# Altium schematic sheet Main.SchDoc: BF350
size A3; Organization: ORGANIZATION; Address1: ADDRESS 1; Address2: ADDRESS 2; Address3: ADDRESS 3; Address4: ADDRESS 4; Revision: -; SheetNumber: 1; SheetTotal: 1; ENG_APP_DATE: --/--/--; DSN_APP_DATE: --/--/--; CHK_APP_DATE: --/--/--
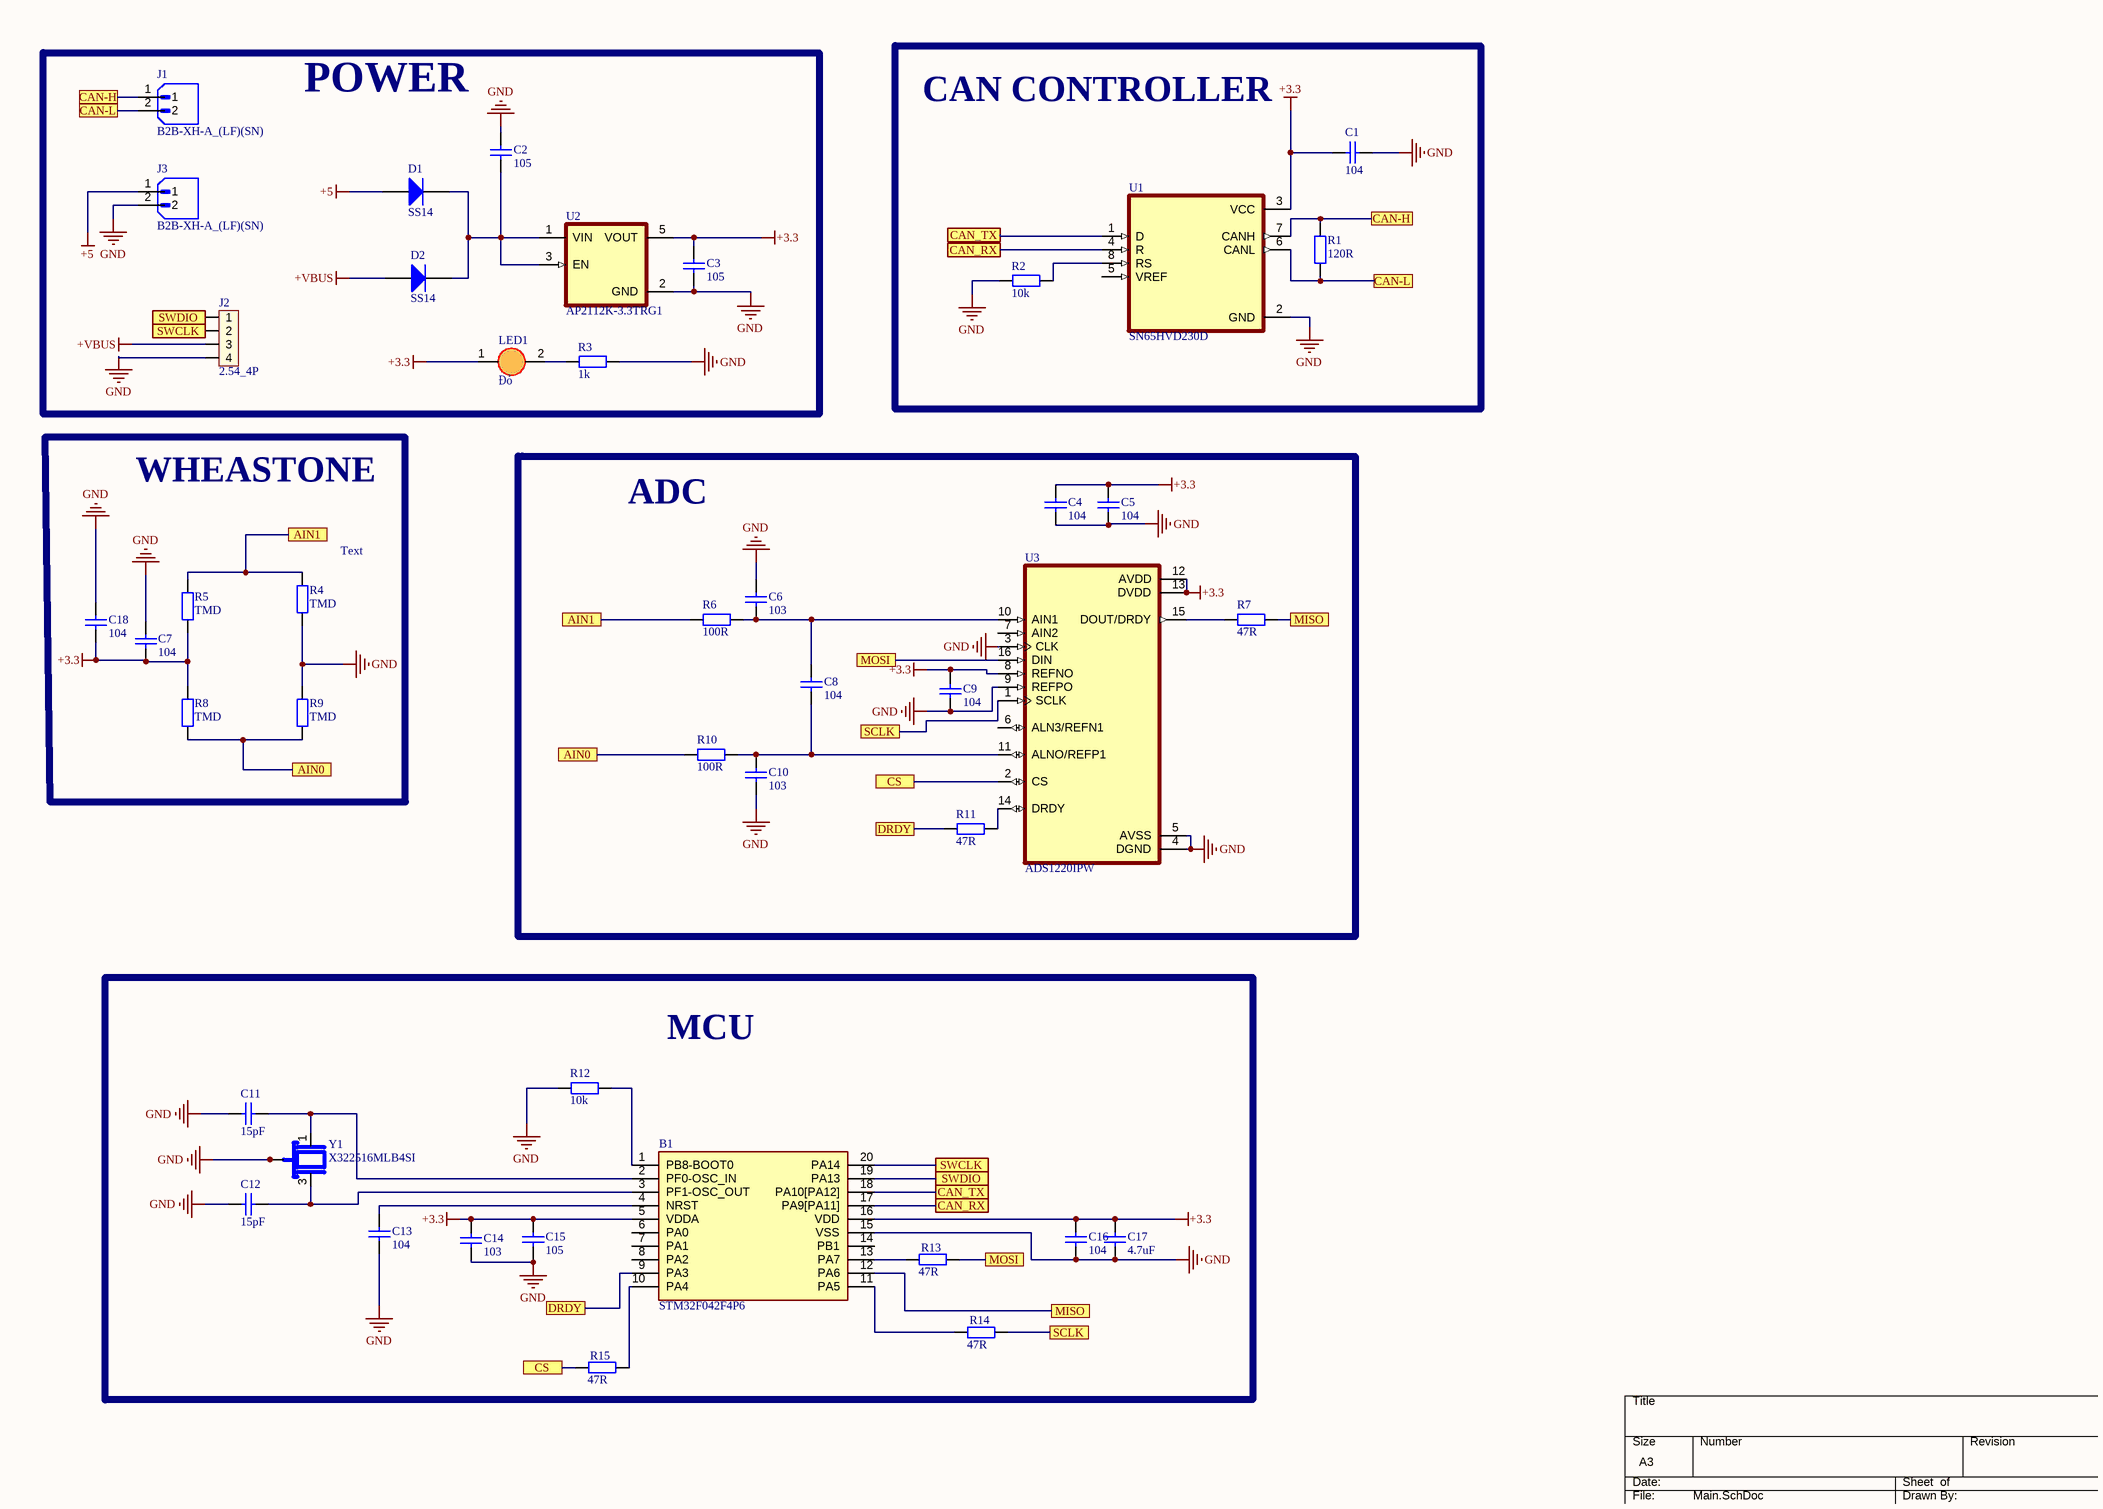
[diagram p0: Main.SchDoc]

## Parts
B1  STM32F042F4P6  [SOP65P640X120-20N]
C1  104  [tu 0603]
C2  105  [tu 0603]
C3  105  [tu 0603]
C4  104  [tu 0603]
C5  104  [tu 0603]
C6  103  [tu 0603]
C7  104  [tu 0603]
C8  104  [tu 0603]
C9  104  [tu 0603]
C10  103  [tu 0603]
C11  15pF  [tu 0603]
C12  15pF  [tu 0603]
C13  104  [tu 0603]
C14  103  [tu 0603]
C15  105  [tu 0603]
C16  104  [tu 0603]
C17  4.7uF  [tu 0805]
C18  104  [tu 0603]
D1  SS14  [DIODE SMD]
D2  SS14  [DIODE SMD]
J1  B2B-XH-A_(LF)(SN)  [JST_B2B-XH-A_(LF)(SN)]
J2  2.54_4P  [JP4]
J3  B2B-XH-A_(LF)(SN)  [JST_B2B-XH-A_(LF)(SN)]
LED1  Đỏ  [led 0805]
R1  120R  [tro smd 0603]
R2  10k  [tro smd 0603]
R3  1k  [tro smd 0603]
R4  TMD  [tro smd 1206]
R5  TMD  [tro smd 1206]
R6  100R  [tro smd 0603]
R7  47R  [tro smd 0603]
R8  TMD  [tro smd 1206]
R9  TMD  [tro smd 1206]
R10  100R  [tro smd 0603]
R11  47R  [tro smd 0603]
R12  10k  [tro smd 0603]
R13  47R  [tro smd 0603]
R14  47R  [tro smd 0603]
R15  47R  [tro smd 0603]
U1  SN65HVD230D  [SOIC127P599X175-8N]
U2  AP2112K-3.3TRG1  [SOT95P285X140-5N]
U3  ADS1220IPW  [SOP65P640X120-16N]
Y1  X322516MLB4SI  [OSC_X322516MLB4SI]

## Ports
AIN0, AIN1, CAN-H, CAN-L, CAN_RX, CAN_TX, CS, DRDY, MISO, MOSI, SCLK, SWCLK, SWDIO

## Nets
+3.3: B1.5(VDDA) B1.16(VDD) C1.1 C3.2 C4.1 C5.1 C7.2 C9.1 C14.1 C15.2 C16.1 C17.1 C18.2 LED1.1(A) R5.1 R8.2 U1.3(VCC) U2.5(VOUT) U3.8(REFNO) U3.12(AVDD) U3.13(DVDD)
+5: D1.1(A) J3.1
+VBUS: D2.1(A) J2.3
GND: B1.15(VSS) C1.2 C2.1 C3.1 C4.2 C5.2 C6.1 C7.1 C9.2 C10.2 C11.1 C12.1 C13.2 C14.2 C15.1 C16.2 C17.2 C18.1 J2.4 J3.2 R2.1 R3.2 R4.1 R9.1 R12.1 U1.2(GND) U2.2(GND) U3.3(CLK) U3.4(DGND) U3.5(AVSS) U3.9(REFPO) Y1.2(GND) Y1.4(GND)
AIN0: R8.1 R9.2 R10.1 ; port AIN0
AIN1: R4.2 R5.2 R6.1 ; port AIN1
CAN-H: J1.1 R1.2 U1.7(CANH) ; port CAN-H
CAN-L: J1.2 R1.1 U1.6(CANL) ; port CAN-L
CAN_RX: B1.17(PA9[PA11]) U1.4(R) ; port CAN_RX
CAN_TX: B1.18(PA10[PA12]) U1.1(D) ; port CAN_TX
CS: R15.1 U3.2(CS) ; port CS
DRDY: B1.9(PA3) R11.1 ; port DRDY
MISO: B1.12(PA6) R7.2 ; port MISO
MOSI: R13.2 U3.16(DIN) ; port MOSI
SCLK: R14.2 U3.1(SCLK) ; port SCLK
SWCLK: B1.20(PA14) J2.2 ; port SWCLK
SWDIO: B1.19(PA13) J2.1 ; port SWDIO
NetB1_1: B1.1(PB8-BOOT0) R12.2
NetB1_2: B1.2(PF0-OSC_IN) C11.2 Y1.1
NetB1_3: B1.3(PF1-OSC_OUT) C12.2 Y1.3
NetB1_4: B1.4(NRST) C13.1
NetB1_10: B1.10(PA4) R15.2
NetB1_11: B1.11(PA5) R14.1
NetB1_13: B1.13(PA7) R13.1
NetC2_2: C2.2 D1.2(K) D2.2(K) U2.1(VIN) U2.3(EN)
NetC6_2: C6.2 C8.1 R6.2 U3.10(AIN1)
NetC8_2: C8.2 C10.1 R10.2 U3.11(ALNO/REFP1)
NetLED1_2: LED1.2(K) R3.1
NetR2_2: R2.2 U1.8(RS)
NetR7_1: R7.1 U3.15(DOUT/DRDY)
NetR11_2: R11.2 U3.14(DRDY)

Not connected (* = marked no-connect by the designer): B1 6(PA0) 7(PA1) 8(PA2) 14(PB1); U1 5(VREF); U3 6(ALN3/REFN1) 7(AIN2)

## Notes on the sheet
- POWER
- CAN CONTROLLER
- WHEASTONE
- ADC
- (near R4) Text
- MCU
- THIS DOCUMENT AND THE DATA DISCLOSED HEREIN OR
- HEREWITH IS THE PROPERTY OF ALTIUM LIMITED AND MAY
- DWG NO:
- REVISION
- REV:
- DESCRIPTION
- DATE
- APPROVED
- BE FREELY DISTRIBUTED IN WHOLE. NO RIGHTS ARE
- RESERVED OR EXPRESS OR IMPLIED WARANTEE GIVEN.
- ENG:
- APPROVALS
- PROJECT
- DSN:
- CHK:
- REFERENCE DOCUMENTS
- PROJECT REVISION:
- TITLE
- DOCUMENT REVISION:
- DESIGN ITEM:
- BOM:
- FAB DWG:
- PCB DWG:
- ASSY DWG:
- SCALE:
- A3
- SIZE
- CAGE CODE
- FILE NAME
- DWG NO.
- SHEET
- OF
- REV

## Library data of the parts
B1 = STM32F042F4P6: ARM-based 32-bit MCU, up to 32 KB Flash, crystal-less USB FS 2.0, CAN, 9 timers, ADC and comm. interfaces, 2.0 - 3.6 V; Manufacturer_Name: STMicroelectronics; Geometry.Height: 1.2mm; Manufacturer_Part_Number: STM32F042F4P6; Mouser Part Number: 511-STM32F042F4P6; Mouser Price/Stock: https://www.mouser.co.uk/ProductDetail/STMicroelectronics/STM32F042F4P6?qs=4b8myOmUP%252BvvhAaQx2eFdg%3D%3D; Arrow Part Number: STM32F042F4P6; Arrow Price/Stock: https://www.arrow.com/en/products/stm32f042f4p6/stmicroelectronics?utm_currency=USD&region=nac; Datasheet Link: https://www.st.com/resource/en/datasheet/stm32f042c4.pdf
C1 C4 C5 C7-C9 C11-C13 C16 C18 = Tu 0603 104 50V 10%: Dán; Don_Vi: Con; So_Chan: 2; Ten_Linh_Kien: Tụ 0603 104-100nF 10% 50V; Ma_Hang: MH004568; Chung_Loai: Dán; Kieu_Chan: *
C2 C3 C15 = Tu 0603 105 16V 20%: Dán; Don_Vi: Con; So_Chan: 2; Ten_Linh_Kien: Tụ 0603 105-1uF 20% 16V; Ma_Hang: MH004574; Chung_Loai: Dán; Kieu_Chan: *
C6 C10 C14 = Tu 0603 103 50V 10%: Dán; Don_Vi: Con; So_Chan: 2; Ten_Linh_Kien: Tụ 0603 103-10nF 10% 50V; Ma_Hang: MH004567; Chung_Loai: Dán; Kieu_Chan: *
C17 = Tu 0805 475 25V 20%: Dán; Don_Vi: Con; So_Chan: 2; Ten_Linh_Kien: Tụ 0805 475-4.7uF 20% 25V; Ma_Hang: MH004276; Chung_Loai: Dán; Kieu_Chan: *
D1 D2 = Diode SS14 ( 1N5819): Dán; Ma_Hang: MH002211; Don_Vi: Con; Ten_Linh_Kien: Diode SS14 DO214 Schottky 1A 40V ( 1N5819 DO214); Chung_Loai: Dán; Ghi_Chu: *; Kieu_Chan: *
J1 J3 = B2B-XH-A_(LF)(SN): Connector Header Through Hole 2 position 0.098 (2.50mm); MF: JST Sales; MP: B2B-XH-A (LF)(SN); SnapEDA_Link: https://www.snapeda.com/parts/B2B-XH-A%20(LF)(SN)/JST+Sales+America+Inc./view-part/?ref=snap; Package: None; Value: *; Check_prices: https://www.snapeda.com/parts/B2B-XH-A%20(LF)(SN)/JST+Sales+America+Inc./view-part/?ref=eda
J2 = Jum Don Duc 2.54_4P: Cắm st link cho stm32; Don_Vi: Con; Ma_Hang: MH000903; Value: Jump Đơn Đực 2.54MM 1x40P Thẳng 11MM; Ghi Chu: *; Kieu Chan: *; Chung_Loai: Cắm
LED1 = LED 0805: Dán; Don_Vi: Con; Chung_Loai: Cắm; Ten_Linh_kien: *; Ghi_Chu: *; Kieu_Chan: *; Ma_Hang: *
R1 R6 R10 = Tro 0603 5% 100R: Dán; Don_Vi: Con; So_Chan: 2; Ten_Linh_Kien: Trở 0603 5% 100R; Ma_Hang: MH006315; Chung_Loai: Dán; Kieu_Chan: *
R2 R12 = Tro 0603 1% 10k: Dán; Don_Vi: Con; So_Chan: 2; Ten_Linh_Kien: Trở 0603 1% 10k; Ma_Hang: MH006333; Chung_Loai: Dán; Kieu_Chan: *
R3 = Tro 0603 1% 1k: Dán; So_Chan: 2; Don_Vi: Con; Ten_Linh_Kien: Trở 0603 1% 1k; Ma_Hang: MH006334; Chung_Loai: Dán; Kieu_Chan: *
R4 R5 R8 R9 = Tro 1206 1% 1k: Dán; Don_Vi: Con; So_Chan: 2; Ten_Linh_Kien: Trở 1206 1% 1k; Ma_Hang: MH005880; Chung_Loai: Dán; Kieu_Chan: *
R7 R11 R13-R15 = Tro 0603 1% 56R: Dán; Don_Vi: Con; So_Chan: 2; Ten_Linh_Kien: Trở 0603 1% 56R; Ma_Hang: MH006338; Chung_Loai: Dán; Kieu_Chan: *
U1 = SN65HVD230D: 3.3 V CAN Transceiver with Standby Mode; MF: Texas Instruments; SnapEDA_Link: https://www.snapeda.com/parts/SN65HVD230D/Texas+Instruments/view-part/?ref=snap; Package: SOIC-8 Texas Instruments; Value: *; MP: SN65HVD230D; Check_prices: https://www.snapeda.com/parts/SN65HVD230D/Texas+Instruments/view-part/?ref=eda
U2 = AP2112K-3.3TRG1: Linear Voltage Regulator IC Positive Fixed 1 Output 600mA SOT-25; MF: Diodes Inc.; Value: *; Purchase-URL: https://pricing.snapeda.com/search/part/AP2112K-3.3TRG1/?ref=eda; Package: SOT-753 Diodes Inc.; Availability: In Stock; Check_prices: https://www.snapeda.com/parts/AP2112K-3.3TRG1/Diodes+Inc./view-part/?ref=eda; Price: None; SnapEDA_Link: https://www.snapeda.com/parts/AP2112K-3.3TRG1/Diodes+Inc./view-part/?ref=snap; MP: AP2112K-3.3TRG1
U3 = ADS1220IPW: 24-bit, 2-kSPS, four-channel, low-power, delta-sigma ADC with PGA, VREF, SPI and two IDACs; MF: Texas Instruments; SnapEDA_Link: https://www.snapeda.com/parts/ADS1220IPW/Texas+Instruments/view-part/?ref=snap; Package: TSSOP-16 Texas Instruments; Value: *; MP: ADS1220IPW; Check_prices: https://www.snapeda.com/parts/ADS1220IPW/Texas+Instruments/view-part/?ref=eda
Y1 = X322516MLB4SI: External dimensions: 3.2 x 2.5 x 0.8 mm.Frequency range: 11.0592MHz ~54MHz; MF: YXC; SnapEDA_Link: https://www.snapeda.com/parts/X322516MLB4SI/YXC/view-part/?ref=snap; Package: Package; Value: *; MP: X322516MLB4SI; Check_prices: https://www.snapeda.com/parts/X322516MLB4SI/YXC/view-part/?ref=eda